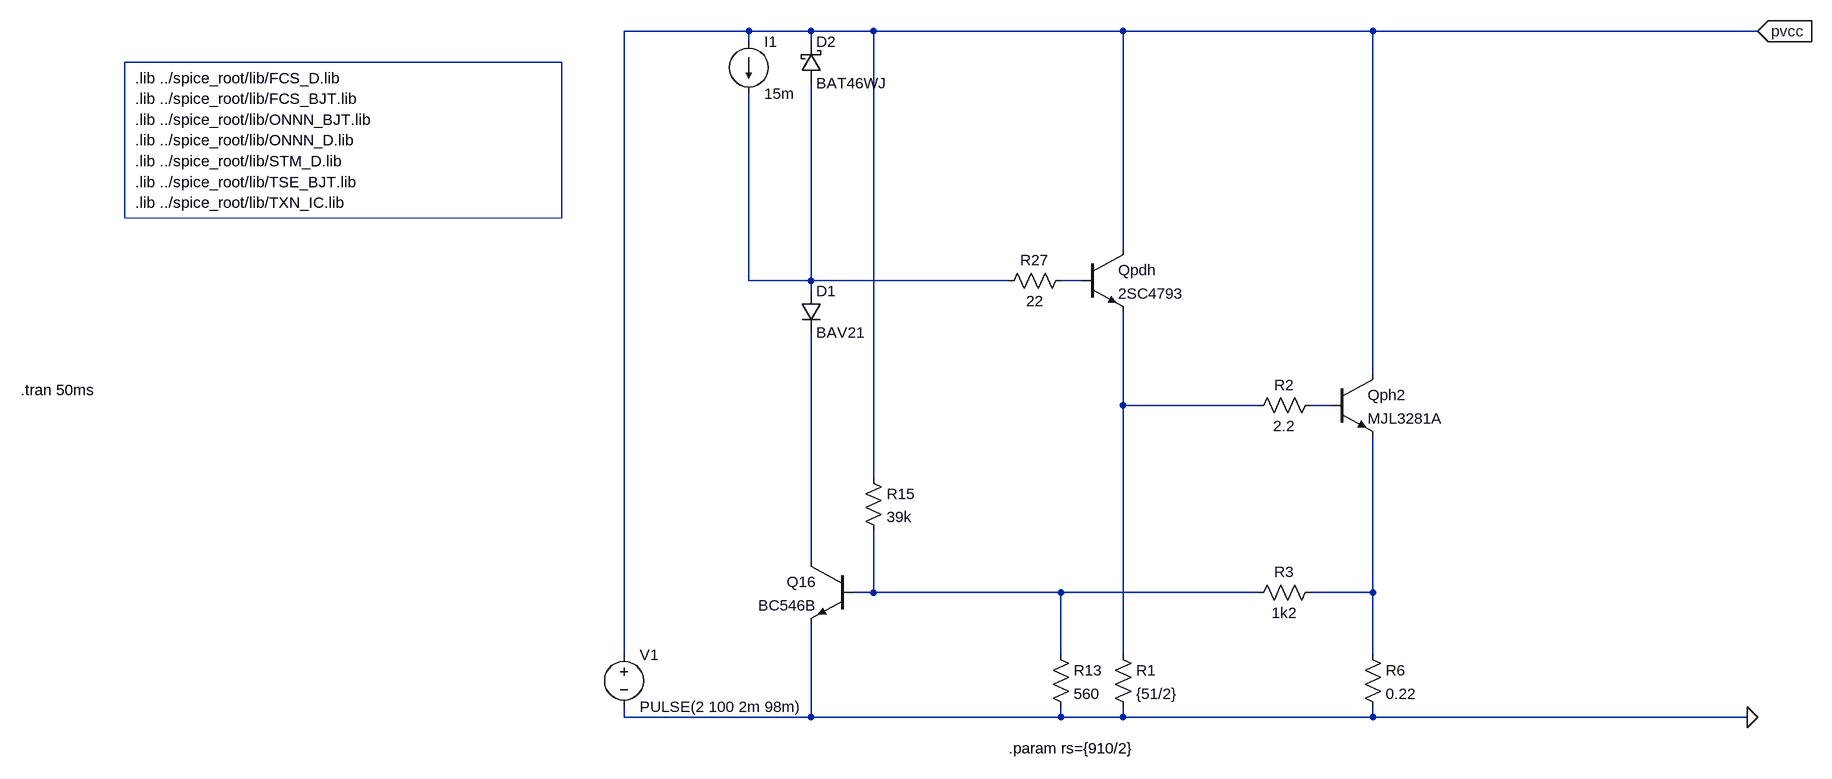
[diagram p0: schematic pab3bbb-compact-prot-2slope.asc]
pab3bbb-compact-prot-2slope.asc, the LTspice schematic file:
Version 4
SHEET 1 6124 2336
WIRE 1056 -1280 864 -1280
WIRE 1152 -1280 1056 -1280
WIRE 1248 -1280 1152 -1280
WIRE 1632 -1280 1248 -1280
WIRE 2016 -1280 1632 -1280
WIRE 2608 -1280 2016 -1280
WIRE 1056 -1264 1056 -1280
WIRE 1152 -1264 1152 -1280
WIRE 1632 -944 1632 -1280
WIRE 1056 -896 1056 -1184
WIRE 1152 -896 1152 -1200
WIRE 1152 -896 1056 -896
WIRE 1456 -896 1152 -896
WIRE 1568 -896 1536 -896
WIRE 1152 -880 1152 -896
WIRE 2016 -752 2016 -1280
WIRE 1632 -704 1632 -848
WIRE 1840 -704 1632 -704
WIRE 1952 -704 1920 -704
WIRE 1248 -592 1248 -1280
WIRE 1152 -464 1152 -816
WIRE 1248 -416 1248 -512
WIRE 1248 -416 1216 -416
WIRE 1536 -416 1248 -416
WIRE 1840 -416 1536 -416
WIRE 2016 -416 2016 -656
WIRE 2016 -416 1920 -416
WIRE 864 -320 864 -1280
WIRE 1536 -320 1536 -416
WIRE 1632 -320 1632 -704
WIRE 2016 -320 2016 -416
WIRE 864 -224 864 -240
WIRE 1152 -224 1152 -368
WIRE 1152 -224 864 -224
WIRE 1536 -224 1536 -240
WIRE 1536 -224 1152 -224
WIRE 1632 -224 1632 -240
WIRE 1632 -224 1536 -224
WIRE 2016 -224 2016 -240
WIRE 2016 -224 1632 -224
WIRE 2592 -224 2016 -224
FLAG 2608 -1280 pvcc
IOPIN 2608 -1280 In
FLAG 2592 -224 0
SYMBOL res 1552 -912 R90
WINDOW 0 0 56 VBottom 2
WINDOW 3 32 56 VTop 2
SYMATTR InstName R27
SYMATTR Value 22
SYMBOL npn 1568 -944 R0
SYMATTR InstName Qpdh
SYMATTR Value 2SC4793
SYMBOL res 1616 -336 R0
SYMATTR InstName R1
SYMATTR Value {51/2}
SYMBOL npn 1216 -464 M0
SYMATTR InstName Q16
SYMATTR Value BC546B
SYMBOL schottky 1136 -1200 M180
WINDOW 0 24 64 Left 2
WINDOW 3 24 0 Left 2
SYMATTR InstName D2
SYMATTR Value BAT46WJ
SYMATTR Description Diode
SYMATTR Type diode
SYMBOL current 1056 -1264 R0
WINDOW 123 0 0 Left 0
WINDOW 39 0 0 Left 0
SYMATTR InstName I1
SYMATTR Value 15m
SYMBOL voltage 864 -336 R0
WINDOW 123 0 0 Left 0
WINDOW 39 0 0 Left 0
SYMATTR InstName V1
SYMATTR Value PULSE(2 100 2m 98m)
SYMBOL npn 1952 -752 R0
SYMATTR InstName Qph2
SYMATTR Value MJL3281A
SYMBOL res 1936 -720 R90
WINDOW 0 0 56 VBottom 2
WINDOW 3 32 56 VTop 2
SYMATTR InstName R2
SYMATTR Value 2.2
SYMBOL res 2000 -336 R0
SYMATTR InstName R6
SYMATTR Value 0.22
SYMBOL diode 1136 -880 R0
SYMATTR InstName D1
SYMATTR Value BAV21
SYMBOL res 1520 -336 R0
SYMATTR InstName R13
SYMATTR Value 560
SYMBOL res 1232 -608 R0
SYMATTR InstName R15
SYMATTR Value 39k
SYMBOL res 1936 -432 R90
WINDOW 0 0 56 VBottom 2
WINDOW 3 32 56 VTop 2
SYMATTR InstName R3
SYMATTR Value 1k2
TEXT 112 -1144 Left 2 !.lib ../spice_root/lib/ONNN_BJT.lib
TEXT 112 -1080 Left 2 !.lib ../spice_root/lib/STM_D.lib
TEXT 112 -1176 Left 2 !.lib ../spice_root/lib/FCS_BJT.lib
TEXT 112 -1208 Left 2 !.lib ../spice_root/lib/FCS_D.lib
TEXT 112 -1112 Left 2 !.lib ../spice_root/lib/ONNN_D.lib
TEXT 112 -1048 Left 2 !.lib ../spice_root/lib/TSE_BJT.lib
TEXT 112 -1016 Left 2 !.lib ../spice_root/lib/TXN_IC.lib
TEXT -64 -728 Left 2 !.tran 50ms
TEXT 1456 -176 Left 2 !.param rs={910/2}
RECTANGLE Normal 768 -992 96 -1232

The netlist it stands for:
* pab3bbb-compact-prot-2slope.asc
R27 N002 N001 22
Qpdh pvcc N002 N003 0 2SC4793
R1 N003 0 {51/2}
Q16 N005 N006 0 0 BC546B
D2 N001 pvcc BAT46WJ
I1 pvcc N001 15m
V1 pvcc 0 PULSE(2 100 2m 98m)
Qph2 pvcc N004 N007 0 MJL3281A
R2 N004 N003 2.2
R6 N007 0 0.22
D1 N001 N005 BAV21
R13 N006 0 560
R15 pvcc N006 39k
R3 N007 N006 1k2
.model D D
.lib standard.dio
.model NPN NPN
.model PNP PNP
.lib standard.bjt
.lib ../spice_root/lib/ONNN_BJT.lib
.lib ../spice_root/lib/STM_D.lib
.lib ../spice_root/lib/FCS_BJT.lib
.lib ../spice_root/lib/FCS_D.lib
.lib ../spice_root/lib/ONNN_D.lib
.lib ../spice_root/lib/TSE_BJT.lib
.lib ../spice_root/lib/TXN_IC.lib
.tran 50ms
.param rs={910/2}
.backanno
.end